# EAGLE design SwBotMain (EAGLE 6.3)
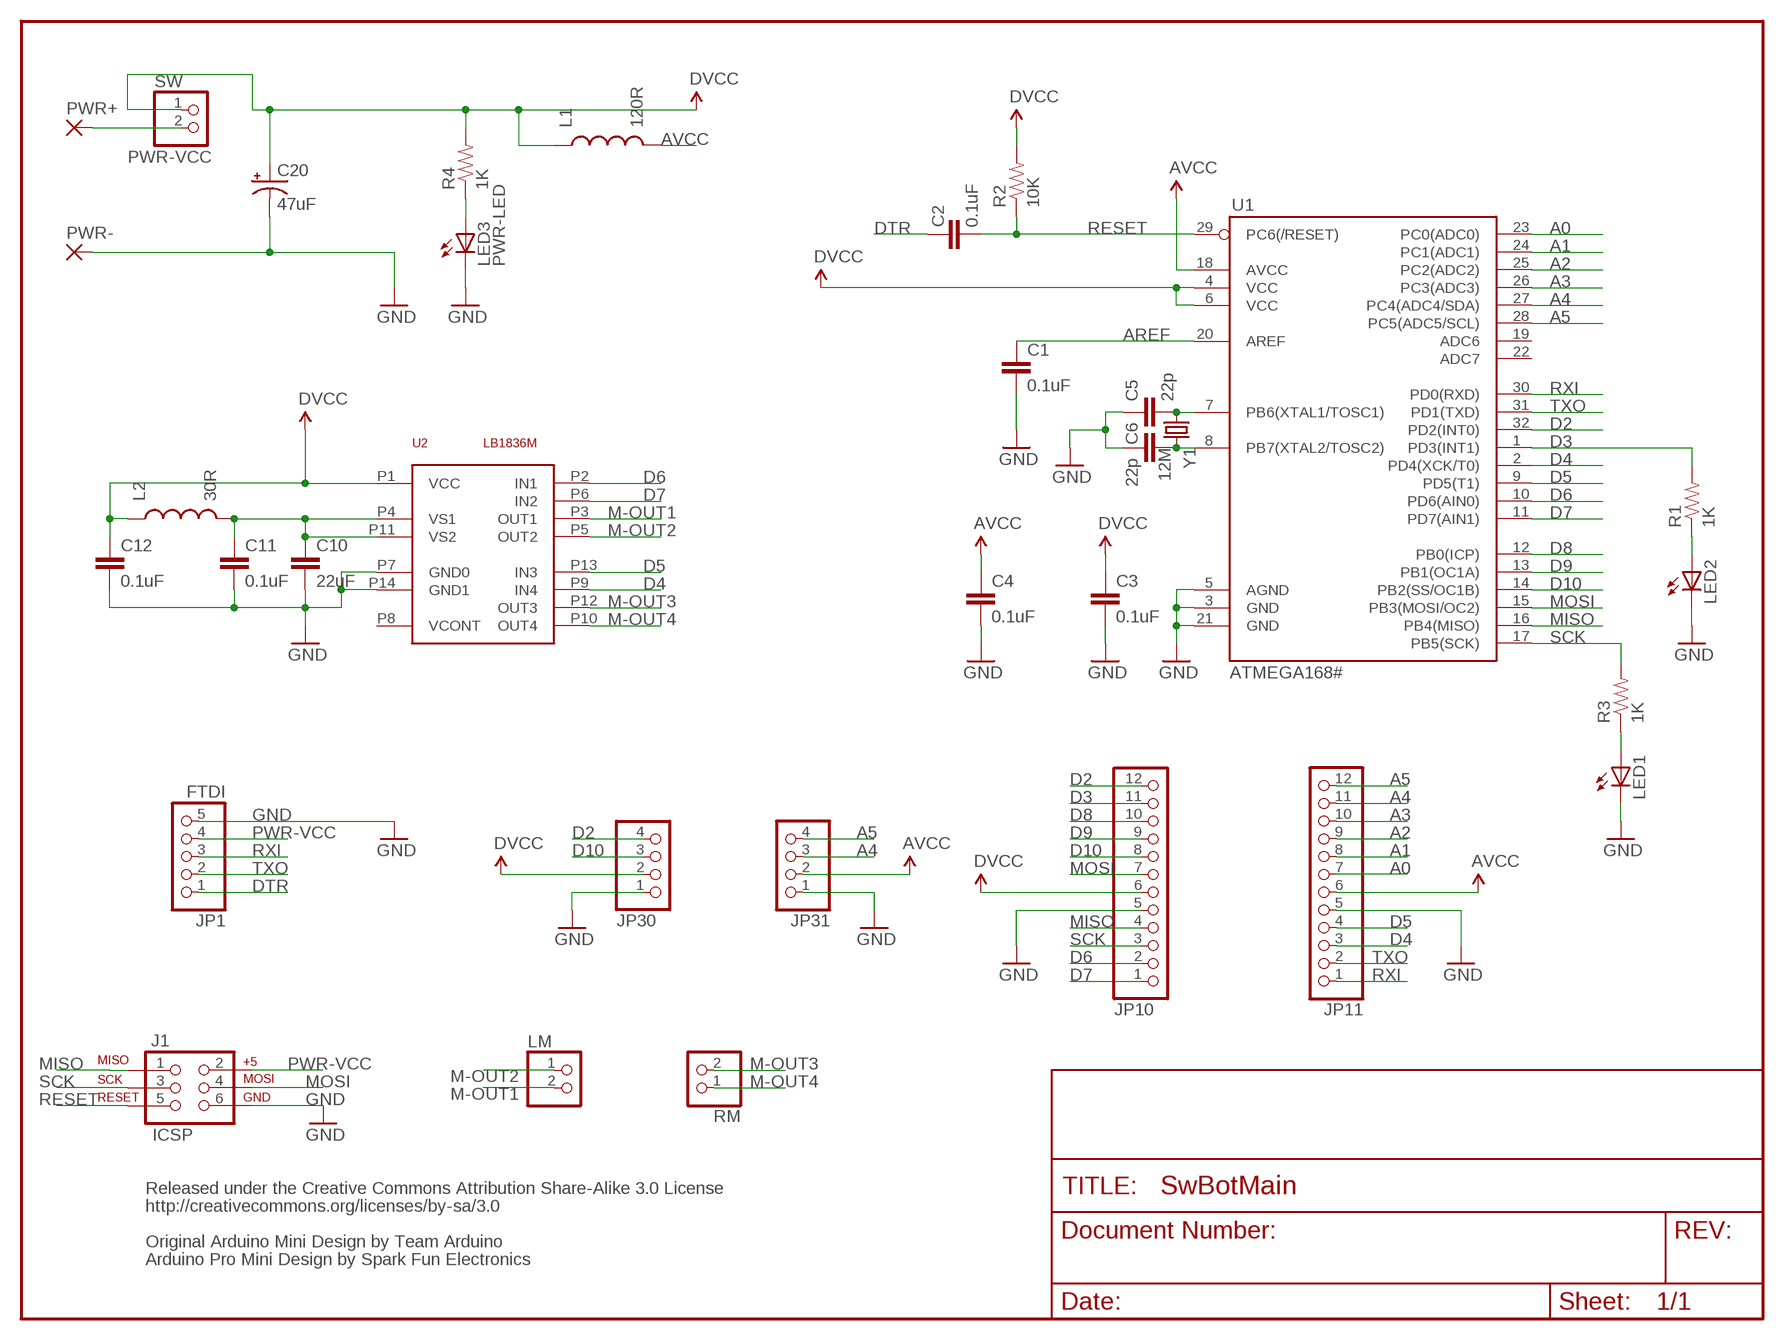
[diagram p0: schematic, sheet 1]

## Parts
C1  0.1uF  CAP0805  [0805]
C2  0.1uF  CAP0805  [0805]
C3  0.1uF  CAP0805  [0805]
C4  0.1uF  CAP0805  [0805]
C5  22p  CAP0805  [0805]
C6  22p  CAP0805  [0805]
C10  22uF  CAP1206  [1206]
C11  0.1uF  CAP0805  [0805]
C12  0.1uF  CAP0805  [0805]
C20  47uF  47UF-TANT  [EIA3528]
J1  ICSP  AVR_SPI_PRG_62X3_LOCK  [2X3_LOCK]
JP1  FTDI  PINHD-1X5  [1X05]
JP10  PINHD-1X12  [1X12]
JP11  PINHD-1X12  [1X12]
JP30  PINHD-1X4  [1X04]
JP31  PINHD-1X4  [1X04]
L1  120R  INDUCTOR0805  [0805]
L2  30R  INDUCTOR0805  [0805]
LED1  LEDCHIP-LED0805  [CHIP-LED0805]
LED2  LEDCHIP-LED0805  [CHIP-LED0805]
LED3  PWR-LED  LED5MM  [LED5MM]
LM  PINHD-1X2  [1X02]
PWR+  SMD2  [SMD1,27-2,54]
PWR-  SMD2  [SMD1,27-2,54]
R1  1K  RESISTOR0805-RES  [0805]
R2  10K  RESISTOR0805-RES  [0805]
R3  1K  RESISTOR0805-RES  [0805]
R4  1K  RESISTOR0805-RES  [0805]
RM  PINHD-1X2  [1X02]
SW  PINHD-1X2  [1X02]
U1  ATMEGA168#  ATMEGA168  [TQFP32-08]
U2  LB1836M  [MFP14S]
Y1  12M  CRYSTALTXC-7A  [CRYSTAL-TXC-7A]

## Nets
A0: JP11.7 U1.23(PC0(ADC0))
A1: JP11.8 U1.24(PC1(ADC1))
A2: JP11.9 U1.25(PC2(ADC2))
A3: JP11.10 U1.26(PC3(ADC3))
A4: JP11.11 JP31.3 U1.27(PC4(ADC4/SDA))
A5: JP11.12 JP31.4 U1.28(PC5(ADC5/SCL))
AREF: C1.1 U1.20(AREF)
AVCC [vcc]: C4.1 JP11.6 JP31.2 L1.2 U1.18(AVCC)
D2: JP10.12 JP30.4 U1.32(PD2(INT0))
D3: JP10.11 R1.2 U1.1(PD3(INT1))
D4: JP11.3 U1.2(PD4(XCK/T0)) U2.P9(IN4)
D5: JP11.4 U1.9(PD5(T1)) U2.P13(IN3)
D6: JP10.2 U1.10(PD6(AIN0)) U2.P2(IN1)
D7: JP10.1 U1.11(PD7(AIN1)) U2.P6(IN2)
D8: JP10.10 U1.12(PB0(ICP))
D9: JP10.9 U1.13(PB1(OC1A))
D10: JP10.8 JP30.3 U1.14(PB2(SS/OC1B))
DTR: C2.2 JP1.1
DVCC [vcc]: C3.1 C12.1 C20.A(+) JP10.6 JP30.2 L1.1 L2.1 R2.2 R4.2 SW.1 U1.4(VCC) U1.6(VCC) U2.P1(VCC)
GND [vcc]: C1.2 C3.2 C4.2 C5.1 C6.2 C10.2 C11.2 C12.2 C20.C(-) J1.6 JP1.5 JP10.5 JP11.5 JP30.1 JP31.1 LED1.C LED2.C LED3.K(C) PWR-.1(P) U1.3(GND) U1.5(AGND) U1.21(GND) U2.P7(GND0) U2.P14(GND1)
M-OUT1 [HighCur]: LM.2 U2.P3(OUT1)
M-OUT2 [HighCur]: LM.1 U2.P5(OUT2)
M-OUT3 [HighCur]: RM.2 U2.P12(OUT3)
M-OUT4 [HighCur]: RM.1 U2.P10(OUT4)
MISO: J1.1 JP10.4 U1.16(PB4(MISO))
MOSI: J1.4 JP10.7 U1.15(PB3(MOSI/OC2))
N$1: C6.1 U1.8(PB7(XTAL2/TOSC2)) Y1.P$2
N$2: C5.2 U1.7(PB6(XTAL1/TOSC1)) Y1.P$1
N$3: LED2.A R1.1
N$4: LED3.A R4.1
N$5 [vcc]: C10.1 C11.1 L2.2 U2.P4(VS1) U2.P11(VS2)
N$7: LED1.A R3.1
PWR-VCC [vcc]: J1.2 JP1.4 PWR+.1(P) SW.2
RESET: C2.1 J1.5 R2.1 U1.29(PC6(/RESET))
RXI: JP1.3 JP11.1 U1.30(PD0(RXD))
SCK: J1.3 JP10.3 R3.2 U1.17(PB5(SCK))
TXO: JP1.2 JP11.2 U1.31(PD1(TXD))
Unconnected: U1.19(ADC6) U1.22(ADC7) U2.P8(VCONT)

## Notes on the sheet
- Released under the Creative Commons Attribution Share-Alike 3.0 License
- http://creativecommons.org/licenses/by-sa/3.0
- Original Arduino Mini Design by Team Arduino
- Arduino Pro Mini Design by Spark Fun Electronics

## Library data of the parts
C1 C3-C6 C10-C12 = SparkFun-Capacitors:CAP: Capacitor Standard 0603 ceramic capacitor, and 0.1" leaded capacitor.
C2 = SparkFun:CAP: Capacitor Standard 0603 ceramic capacitor, and 0.1" leaded capacitor.
C20 = SparkFun-Capacitors:47UF-TANT: 47uF Tantalum SMT CAP-08310- 10V 10% (EIA-3528); PROD_ID: CAP-08310
J1 = SparkFun-Connectors:AVR_SPI_PRG_6: AVR ISP 6 Pin This is the reduced ISP connector for AVR programming. Common on Arduino. This footprint will take up less PCB space and can be used with a 10-pin to 6-pin adapter such as SKU: BOB-08508
JP1 = pinhead:PINHD-1X5: PIN HEADER
JP10 JP11 = pinhead:PINHD-1X12: PIN HEADER
JP30 JP31 = pinhead:PINHD-1X4: PIN HEADER
L1 L2 = SparkFun-Passives:INDUCTOR: Inductors Basic Inductor/Choke - 0603 and 1206. Footprints are not proven and vary greatly between part numbers.
LED1 LED2 = led:LED: LED OSRAM: - CHIPLED LG R971, LG N971, LY N971, LG Q971, LY Q971, LO R971, LY R971 LH N974, LH R974 LS Q976, LO Q976, LY Q976 LO Q996 - Hyper CHIPLED LW Q18S LB Q993, LB Q99A, LB R99A - SideLED LS A670, LO A670, LY A670, LG A670, LP A670 LB A673, LV A673, LT A673, LW A673 LH A674 LY A675 LS A676, LA A676, LO A676, LY A676, LW A676 LS A679, LY A679, LG A679 - Hyper Micro SIDELED® LS Y876, LA Y876, LO Y876, LY Y876 LT Y87S - SmartLED LW L88C, LW L88S LB L89C, LB L89S, LG L890 LS L89K, LO L89K, LY L89K LS L896, LA L896, LO L896, LY L896 - TOPLED LS T670, LO T670, LY T670, LG T670, LP T670 LSG T670, LSP T670, LSY T670, LOP T670, LYG T670 LG T671, LOG T671, LSG T671 LB T673, LV T673, LT T673, LW T673 LH T674 LS T676, LA T676, LO T676, LY T676, LB T676, LH T676, LSB T676, LW T676 LB T67C, LV T67C, LT T67C, LS T67K, LO T67K, LY T67K, LW E67C LS E67B, LA E67B, LO E67B, LY E67B, LB E67C, LV E67C, LT E67C LW T67C LS T679, LY T679, LG T679 LS T770, LO T770, LY T770, LG T770, LP T770 LB T773, LV T773, LT T773, LW T773 LH T774 LS E675, LA E675, LY E675, LS T675 LS T776, LA T776, LO T776, LY T776, LB T776 LHGB T686 LT T68C, LB T68C - Hyper Mini TOPLED® LB M676 - Mini TOPLED Santana® LG M470 LS M47K, LO M47K, LY M47K Source: http://www.osram.convergy.de LUXEON: - LUMILED® LXK2-PW12-R00, LXK2-PW12-S00, LXK2-PW14-U00, LXK2-PW14-V00 LXK2-PM12-R00, LXK2-PM12-S00, LXK2-PM14-U00 LXK2-PE12-Q00, LXK2-PE12-R00, LXK2-PE12-S00, LXK2-PE14-T00, LXK2-PE14-U00 LXK2-PB12-K00, LXK2-PB12-L00, LXK2-PB12-M00, LXK2-PB14-N00, LXK2-PB14-P00, LXK2-PB14-Q00 LXK2-PR12-L00, LXK2-PR12-M00, LXK2-PR14-Q00, LXK2-PR14-R00 LXK2-PD12-Q00, LXK2-PD12-R00, LXK2-PD12-S00 LXK2-PH12-R00, LXK2-PH12-S00 LXK2-PL12-P00, LXK2-PL12-Q00, LXK2-PL12-R00 Source: www.luxeon.com KINGBRIGHT: KA-3528ASYC Source: www.kingbright.com
LED3 = SparkFun-LED:LED: LEDs Standard schematic elements and footprints for 5mm, 3mm, 1206, and 0603 sized LEDs. 5mm - Spark Fun Electronics SKU : COM-00529 (and others)
LM RM SW = pinhead:PINHD-1X2: PIN HEADER
PWR+ PWR- = wirepad:SMD2: SMD PAD
R1-R4 = SparkFun-Passives:RESISTOR: Resistor Basic schematic elements and footprints for 0603, 1206, and PTH resistors.
U1 = SparkFun:ATMEGA168
U2 = LeoBuild:LB1836M
Y1 = SparkFun-FreqCtrl:CRYSTAL: Various standard crystals. Proven footprints. Spark Fun Electronics SKU : COM-00534

## Net classes
0 default: width 0.203 mm
1 vcc: width 0.406 mm
2 HighCur: width 0.406 mm

## Board
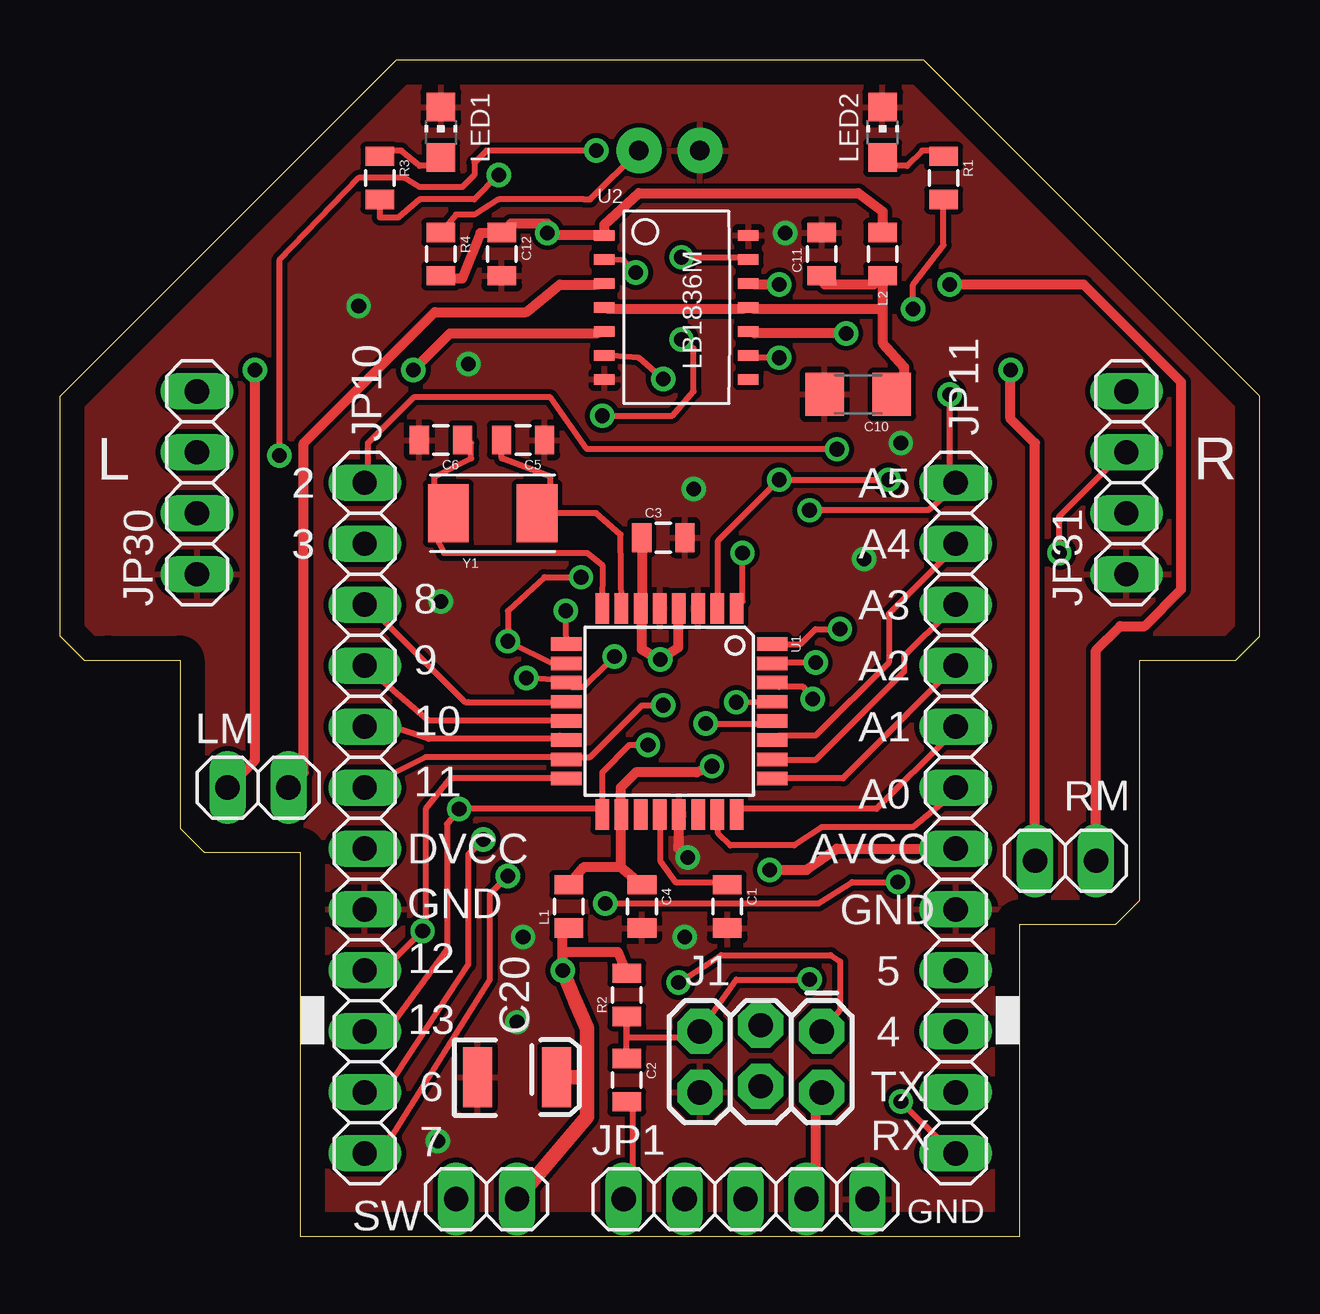
[diagram p1: board, top side]
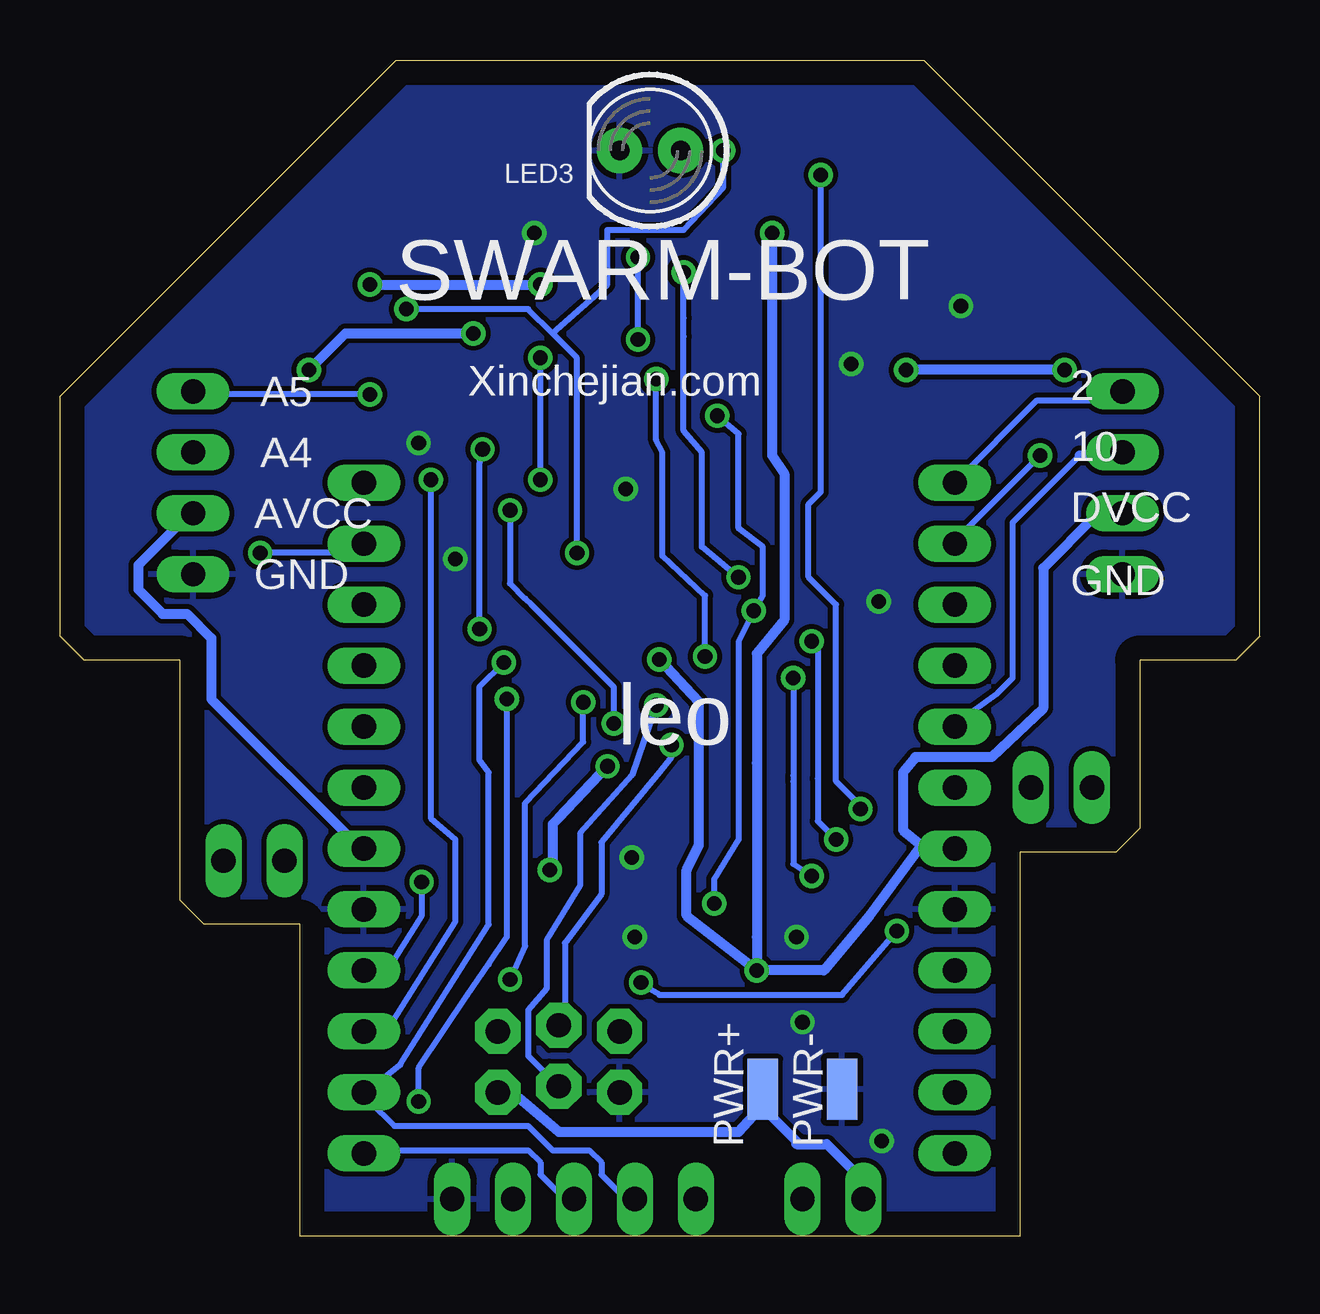
[diagram p2: board, bottom side, seen from below]

Size 50 x 49 mm. Coordinates in mm from the lower left corner, seen from the top.
Outline: 10,0 38,0 40,0 40,13 44,13 45,14 45,15 45,24 49,24 50,25 50,35 36,49 35,49 14,49 0,35 0,25 1,24 2,24 5,24 5,17 6,16 10,16 10,11 10,0
Copper layers (1*16): Top 0.035mm / dielectric 1.5mm / Bottom 0.035mm
Design rules "default *": minimum track width 10mil, minimum drill 24mil, track to track 8mil, track to pad 8mil, pad to pad 8mil, via to via 8mil, smd to smd 8mil, copper to edge 40mil, drill to drill 8mil, minimum pad ring 10mil, minimum via ring 8mil, stop-mask expansion 4mil, vias tented up to drill 0mil, thermal gap 10mil

### Footprints (pad centres in the part's own frame; a part is rotated, then mirrored left to right if it is on the bottom)
0805 = smd 0.8 x 1.2: 1 -0.9,0; 2 0.9,0
1206 = smd 1.6 x 1.8: 1 -1.4,0; 2 1.4,0
EIA3528 = smd 1.2 x 2.5: A 1.65,0; C -1.65,0
2X3_LOCK = drill 1.016 pad 1.88 octagon: 1 0,0; 2 0,2.54; 3 2.54,-0.254; 4 2.54,2.286; 5 5.08,0; 6 5.08,2.54
1X05 = drill 1.016 long: 1 -5.08,0; 2 -2.54,0; 3 0,0; 4 2.54,0; 5 5.08,0
1X12 = drill 1.016 long: 1 -13.97,0; 2 -11.43,0; 3 -8.89,0; 4 -6.35,0; 5 -3.81,0; 6 -1.27,0; 7 1.27,0; 8 3.81,0; 9 6.35,0; 10 8.89,0; 11 11.43,0; 12 13.97,0
1X04 = drill 1.016 long: 1 -3.81,0; 2 -1.27,0; 3 1.27,0; 4 3.81,0
CHIP-LED0805 = smd 1.2 x 1.2: A 0,-1.05; C 0,1.05
LED5MM = drill 0.813 pad 1.88: A -1.27,0; K 1.27,0
1X02 = drill 1.016 long: 1 -1.27,0; 2 1.27,0
SMD1,27-2,54 = smd 1.27 x 2.54: 1 0,0
TQFP32-08 = smd 1.27 x 0.559: 1 -4.293,2.8; 2 -4.293,2; 3 -4.293,1.2; 4 -4.293,0.4; 5 -4.293,-0.4; 6 -4.293,-1.2; 7 -4.293,-2; 8 -4.293,-2.8; 17 4.293,-2.8; 18 4.293,-2; 19 4.293,-1.2; 20 4.293,-0.4; 21 4.293,0.4; 22 4.293,1.2; 23 4.293,2; 24 4.293,2.8 | smd 0.559 x 1.27: 9 -2.8,-4.293; 10 -2,-4.293; 11 -1.2,-4.293; 12 -0.4,-4.293; 13 0.4,-4.293; 14 1.2,-4.293; 15 2,-4.293; 16 2.8,-4.293; 25 2.8,4.293; 26 2,4.293; 27 1.2,4.293; 28 0.4,4.293; 29 -0.4,4.293; 30 -1.2,4.293; 31 -2,4.293; 32 -2.8,4.293
MFP14S = smd 0.45 x 0.85: P1 1,-0.8; P2 2,-0.8; P3 3,-0.8; P4 4,-0.8; P5 5,-0.8; P6 6,-0.8; P7 7,-0.8; P8 7,5.2; P9 6,5.2; P10 5,5.2; P11 4,5.2; P12 3,5.2; P13 2,5.2; P14 1,5.2
CRYSTAL-TXC-7A = smd 1.7 x 2.4: P$1 1.85,0; P$2 -1.85,0

### Placement (x,y rotation side)
C1  27.81,13.73 270 top
C2  23.62,6.49 270 top
C3  25.15,29.1 0 top
C4  24.26,13.73 270 top
C5  19.3,33.16 180 top
C6  15.88,33.16 180 top
C10  33.27,35.07 180 top
C11  31.75,40.91 90 top
C12  18.41,40.91 270 top
C20  19.05,6.62 0 top
J1  31.75,8.53 180 top
JP1  28.57,1.54 0 top
JP10  12.7,17.41 90 top
JP11  37.34,17.41 90 top
JP30  5.71,31.38 90 top
JP31  44.45,31.38 90 top
L1  21.21,13.73 90 top
L2  34.29,40.91 270 top
LED1  15.88,45.99 0 top
LED2  34.29,45.99 0 top
LED3  25.4,45.23 180 bottom
LM  8.26,18.68 0 top
PWR+  20.7,6.11 0 bottom
PWR-  17.4,6.11 0 bottom
R1  36.83,44.09 270 top
R2  23.62,10.05 90 top
R3  13.34,44.09 270 top
R4  15.88,40.91 270 top
RM  41.91,15.64 0 top
SW  17.78,1.54 180 top
U1  25.4,21.86 270 top
U2  23.5,42.69 270 top
Y1  18.03,30.11 0 top

### Tracks (layer width: path | path; a pad name or v marks a point on that pad's centre or on a via)
A0
  Top 0.254: U1.23 27.43,17.29 27.43,16.78 27.94,16.27 30.61,16.27 31.75,17.03 35.56,17.03 37.08,18.3 JP11.7
A1
  Top 0.254: U1.24 28.45,17.8 34.04,17.8 37.08,20.84 JP11.8
A2
  Top 0.254: U1.25 30.1,19.07 32.64,19.07 36.96,23.38 JP11.9
A3
  Top 0.254: U1.26 29.97,19.83 31.5,19.83 35.18,23.51 35.18,24.15 37.08,26.05 JP11.10
A4  (via drill 0.61)
  Top 0.254: U1.27 29.97,20.84 31.5,20.84 34.54,23.89 34.54,25.92 37.08,28.46 JP11.11 | v41.66,28.46 41.66,29.99 44.2,32.53 JP31.3
  Bottom 0.254: v41.66,28.46 37.59,28.46 JP11.11
A5  (via drill 0.61)
  Top 0.254: v26.92,21.35 29.46,21.35 U1.28 | v31.24,30.24 36.2,30.24 37.08,31 JP11.12 37.08,31.51 v37.08,35.07
  Bottom 0.254: v26.92,21.35 26.92,22.88 30.35,26.3 30.61,26.56 31.24,27.19 v31.24,30.24 | v37.08,35.07 44.2,35.07 JP31.4
AREF
  Top 0.254: C1.1 27.56,14.75 25.65,14.75 25.02,15.64 25.02,17.29 U1.20
AVCC  (via drill 0.61)
  Top 0.406: v27.18,19.57 26.54,19.32 24,19.32 23.37,18.68 23.37,17.8 U1.18 23.37,16.78 23.37,15.38 | 23.37,15.38 C4.1 | 23.37,15.38 C4.1 | v29.59,15.26 31.11,15.26 32.38,16.14 JP11.6 | L1.2 21.84,15.38 23.37,15.38 | 23.37,15.38 C4.1 | 23.37,15.38 C4.1
  Bottom 0.406: 37.08,15.76 JP11.6 37.59,16.27 43.69,22.37 43.69,24.91 44.7,25.92 45.72,25.92 46.74,26.94 46.74,27.96 44.7,29.99 JP31.2 44.2,29.99 | v27.18,19.57 29.21,17.41 29.46,17.16 29.46,15.64 v29.59,15.26
D2  (via drill 0.61)
  Top 0.254: U1.32 30.87,24.66 31.5,25.29 v32.51,25.29 | v32.38,32.78 21.97,32.78 20.45,34.94 14.73,34.94 12.83,33.04 12.83,31.51 JP10.12
  Bottom 0.254: v32.51,25.29 32.51,32.15 v32.38,32.78 | JP10.12 9.27,34.81 7.37,34.81 6.1,34.81 JP30.4
D3  (via drill 0.61)
  Top 0.254: v35.56,38.62 35.56,39.64 36.83,41.29 36.83,43.32 R1.2 | v28.45,28.46 28.45,26.43 U1.1 | v9.14,32.53 9.14,40.66 12.45,44.09 14.35,44.09 14.99,43.7 16.76,43.7 17.27,44.21 17.27,44.72 17.78,45.23 v22.35,45.23
  Bottom 0.254: v35.56,38.62 30.48,38.62 29.46,37.61 | 29.46,37.61 28.45,36.59 v28.45,28.46 | v9.14,32.53 12.7,28.97 JP10.11 | v22.35,45.23 22.35,43.7 24,41.93 27.18,41.93 27.18,39.64 29.46,37.61
D4  (via drill 0.61)
  Top 0.254: v29.97,36.59 28.96,36.59 U2.P9 | U1.2 27.43,26.43 27.43,28.97 v29.97,31.51 v34.54,31.51
  Bottom 0.254: v29.97,31.51 v29.97,36.59 | v34.54,31.51 34.54,17.41 33.53,16.53 33.53,13.1 36.32,8.65 37.08,8.65 JP11.3
D5  (via drill 0.61)
  Top 0.254: 21.08,24.65 U1.9 v21.08,26.05 | v22.61,34.18 25.53,34.18 26.42,35.2 26.42,36.97 26.04,37.35 v25.91,37.35 | v25.91,40.78 28.32,40.78 U2.P13 | v22.73,13.86 31.62,13.86 33.02,14.75 v34.92,14.75
  Bottom 0.254: v22.61,34.18 21.72,33.42 21.72,29.48 20.7,28.72 20.7,26.69 v21.08,26.05 21.72,24.78 21.72,16.53 22.73,14.88 v22.73,13.86 | v25.91,37.35 v25.91,40.78 | v34.92,14.75 34.92,13.35 36.2,11.32 JP11.4
D6  (via drill 0.61)
  Top 0.254: v24,40.15 23.5,40.66 U2.P2 | v21.72,27.45 20.19,27.45 18.67,26.05 v18.67,24.78 18.89,24.66 20.45,23.89 20.83,23.89 U1.10 | v17.65,16.53 17.02,15.89 17.02,11.32 13.59,6.11 JP10.2
  Top 0.406: 18.89,24.66 v18.67,24.78
  Bottom 0.254: v24,40.15 24,38.24 24,37.48 24,33.54 23.24,32.66 23.24,28.72 v21.72,27.45 | v21.72,27.45 21.84,27.57 v21.72,27.45 | v18.67,24.78 18.41,24.4 18.41,19.07 18.41,17.29 v17.65,16.53
D7  (via drill 0.61)
  Top 0.254: v25.15,35.7 24.13,36.59 U2.P6 | v23.11,24.15 22.86,23.89 21.84,22.88 21.34,22.88 | 21.34,22.88 U1.11 | 21.34,22.88 21.08,23.13 v19.43,23.26 | v18.67,15 17.91,14.24 17.91,10.68 13.84,4.21 JP10.1
  Bottom 0.254: v25.15,35.7 25.15,33.16 24.89,32.66 24.89,28.34 23.11,26.69 v23.11,24.15 | v19.43,23.26 19.43,19.19 19.43,18.94 19.43,15.51 v18.67,15
D8
  Top 0.254: U1.12 20.83,22.24 17.02,22.24 16.89,22.24 16.76,22.37 12.7,26.43 JP10.10
D9
  Top 0.254: U1.13 20.83,21.48 15.37,21.48 JP10.9
D10
  Top 0.254: U1.14 20.83,20.84 20.83,20.72 15.37,20.72 13.84,21.23 JP10.8
  Bottom 0.254: JP10.8 12.7,21.35 10.92,22.62 10.29,23.26 10.29,29.73 10.16,29.86 7.49,32.53
  Bottom 0.406: 7.49,32.53 5.84,32.53 JP30.3
DTR
  Top 0.254: C2.2 23.88,5.6 23.88,1.54 JP1.1
DVCC  (via drill 0.61)
  Top 0.406: U1.4 25.78,26.13 25.78,24.53 25.4,24.27 v25.02,24.02 24.26,24.45 24.26,25.8 24.26,26.15 U1.6 24.26,26.22 24.26,29.48 24.25,29.34 C3.1 | R4.2 16.13,39.89 16.26,39.89 16.76,39.89 17.53,41.8 C12.1 18.8,42.18 20.32,42.18 v20.32,41.8 20.59,41.69 U2.P1 22.7,42.14 24.13,43.45 33.27,43.45 34.29,42.69 L2.1 | 20.95,12.97 L1.1 20.95,12.72 20.95,11.83 | R2.2 23.25,11.83 20.95,11.83 | 20.95,11.19 20.95,11.57 | 20.95,11.57 20.95,11.83 | 21.97,6.62 C20.A | 20.95,11.83 20.95,11.57 | 20.95,11.57 v20.95,11.06
  Top 0.61: SW.1 21.97,4.97 21.97,6.62 | C20.A 21.97,6.62 | 21.97,6.62 21.97,8.65 21.46,9.79 v20.95,11.06
  Bottom 0.406: v25.02,24.02 23.37,22.24 23.37,16.27 23.88,15.26 23.88,13.35 v20.95,11.06 | v20.32,41.8 20.32,32.53 19.81,31.77 19.81,25.67 20.95,24.27 20.95,19.7 20.95,12.46 v20.95,11.06 | JP10.6 14.1,16.27 | 14.1,16.27 16.26,13.35 18.16,11.06 v20.95,11.06 | v20.95,11.06 20.95,10.81 v20.95,11.06 | JP30.2 6.86,29.99 9.02,27.83 9.02,21.99 11.18,19.95 14.35,19.95 14.86,19.32 14.86,16.91 14.1,16.27
GND  (via drill 0.61)
  Top 0.406: C20.C 17.4,5.61 | U1.21 25.78,17.57 25.78,17.16 25.78,16.27 25.78,16.14 v26.16,15.76
  other vias: 12.45,38.75 26.42,31.13 33.53,28.21 15.75,3.95 19.05,8.91 35.05,33.04 15.88,26.43 26.04,12.46 19.3,12.46 17.02,36.34 30.23,41.8
  pour Bottom: 0.38,48.4 49.4,48.78 49.15,-0.49 0.51,-0.49
  pour Top: 0.25,-0.49 49.66,-0.49 49.91,48.78 0.13,48.66
M-OUT1
  Top 0.406: U2.P3 22.35,39.64 20.83,39.64 19.43,38.5 15.62,38.5 10.16,33.04 10.16,19.32 9.65,18.81 LM.2
M-OUT2  (via drill 0.61)
  Top 0.406: v14.73,36.08 16.26,37.61 22.35,37.61 U2.P5 | v8.13,36.08 8.13,19.83 7.11,18.81 LM.1
  Bottom 0.406: v8.13,36.08 v14.73,36.08
M-OUT3  (via drill 0.61)
  Top 0.406: v29.97,39.64 28.96,39.64 U2.P12 | v37.08,39.64 42.67,39.64 46.74,35.58 46.74,26.94 45.21,25.42 44.2,25.42 43.18,24.4 43.18,15.76 RM.2
  Bottom 0.406: v37.08,39.64 v29.97,39.64
M-OUT4  (via drill 0.61)
  Top 0.406: v32.77,37.61 28.96,37.61 U2.P10 | v39.62,36.08 39.62,34.05 40.64,33.04 40.64,15.76 RM.1
  Bottom 0.406: v32.77,37.61 38.1,37.61 v39.62,36.08
MISO  (via drill 0.61)
  Top 0.254: v25.78,10.56 27.56,11.7 32.13,11.7 32.51,11.45 32.51,9.41 J1.1 | JP10.4 13.59,11.06 13.59,11.19 v15.11,12.72 15.24,13.22 15.24,17.54 15.24,17.8 16.26,19.07 16.38,19.07 U1.16
  Bottom 0.254: v25.78,10.56 25.65,10.43 25.02,10.05 24.38,10.05 17.4,10.05 v15.11,12.72
MOSI  (via drill 0.61)
  Top 0.254: JP10.7 15.24,19.95 20.83,19.95 U1.15 21.72,19.95 22.1,19.95 24.26,22.11 v25.15,22.11
  Bottom 0.254: v25.15,22.11 26.16,19.19 28.32,16.78 28.32,14.62 29.72,12.34 29.72,10.3 30.48,9.41 30.48,7.51 J1.4
N$1
  Top 0.254: C6.1 16.76,33.29 17.14,33.04 17.14,32.4 15.62,31.64 15.62,30.75 16.26,30.5 Y1.P$2 15.62,29.23 16,28.46 21.97,28.46 22.61,27.96 U1.8
N$2
  Top 0.254: U1.7 23.37,29.23 22.35,30.11 Y1.P$1 20.45,30.5 20.45,31.64 18.41,32.4 18.41,33.04 C5.2
N$3
  Top 0.254: LED2.A 34.54,44.59 35.31,44.59 35.94,45.23 36.83,45.23 R1.1
N$4
  Top 0.254: R4.1 16.51,42.56 17.27,42.56 18.29,43.2 21.84,43.2 22.1,43.2 LED3.A
N$5
  Top 0.406: U2.P4 22.86,38.62 28.45,38.62 U2.P11 28.96,38.62 34.29,38.62 | C11.1 31.88,39.64 33.91,39.64 L2.2 34.29,39.77 34.29,38.62 | 34.29,38.62 34.29,37.23 35.18,36.21 35.18,35.07 34.42,34.56 C10.1
N$7
  Top 0.254: R3.1 13.72,45.23 14.22,45.23 14.99,44.59 15.75,44.59 LED1.A
PWR-VCC
  Top 0.406: JP1.4 31.5,1.54 31.5,5.6 J1.2
  Bottom 0.406: 20.83,7.13 20.83,6.37 | 20.83,6.37 20.83,6.11 20.83,5.6 20.7,5.48 | J1.2 30.86,5.73 29.21,4.33 21.72,4.33 20.7,5.48 | 20.7,5.48 20.32,5.1 20.32,4.97 19.3,3.95 19.3,3.83 18.03,3.83 16.76,2.56 16.76,2.17 | PWR+.1 20.7,6.24 20.83,6.37
  Bottom 0.61: 16.76,2.17 SW.2
RESET  (via drill 0.61)
  Top 0.254: C2.1 23.62,8.27 | 23.62,8.27 R2.1 23.62,8.27 | 23.62,8.27 25.91,8.27 J1.5 28.19,10.68 v31.24,10.68 | v28.19,22.24 U1.29
  Bottom 0.254: v31.24,10.68 30.61,12.08 30.61,18.05 28.19,20.59 28.19,22.11 v28.19,22.24
RXI  (via drill 0.61)
  Top 0.254: v31.37,22.37 30.99,22.88 29.97,22.88 U1.30 | v35.05,5.6 37.08,3.57 JP11.1
  Bottom 0.254: v31.37,22.37 31.37,21.99 31.37,12.46 32.13,11.32 33.02,10.05 35.05,7 v35.05,5.6 | JP1.3 28.96,1.54 29.97,2.56 29.97,3.06 30.48,3.57 37.08,3.57 JP11.1
SCK  (via drill 0.61)
  Top 0.254: v18.29,44.21 17.27,43.2 14.99,43.2 14.1,42.43 13.34,42.43 R3.2 | 22.61,17.8 v16.64,17.8 16.13,17.16 16.13,11.95 13.72,8.65 JP10.3 | 22.61,17.8 U1.17 22.61,17.8 | v24.51,20.46 23.75,20.46 22.61,19.32 22.61,17.8
  Bottom 0.254: v18.29,44.21 18.29,31 18.8,30.5 18.8,27.45 17.65,26.3 17.65,18.94 16.64,17.92 v16.64,17.8 | v24.51,20.46 24.51,19.95 25.02,19.32 27.43,16.4 27.43,14.24 28.96,12.21 28.96,9.16 J1.3
TXO  (via drill 0.61)
  Top 0.254: v31.5,23.89 29.97,23.89 U1.31
  Bottom 0.254: v31.5,23.89 32.51,22.88 32.51,19.83 32.13,19.32 32.13,12.97 35.81,7.13 37.08,6.11 JP11.2 37.08,5.6 36.07,4.59 30.48,4.59 29.46,3.57 27.94,3.57 27.43,3.06 27.43,2.56 26.42,1.54 JP1.2

### Text on the board
tPlace: L | R | 2 | A5 | 3 | A4 | 8 | A3 | 9 | A2 | 10 | A1 | 11 | A0 | DVCC | AVCC | GND | GND | 12 | 5 | 13 | 4 | 6 | TX | RX | 7 | GND
bPlace: SWARM-BOT | 2 | Xinchejian.com | A5 | 10 | A4 | DVCC | AVCC | GND | GND | leo